# EAGLE design Kube_Base_ESP32_HiLetGo (EAGLE 9.6.2)
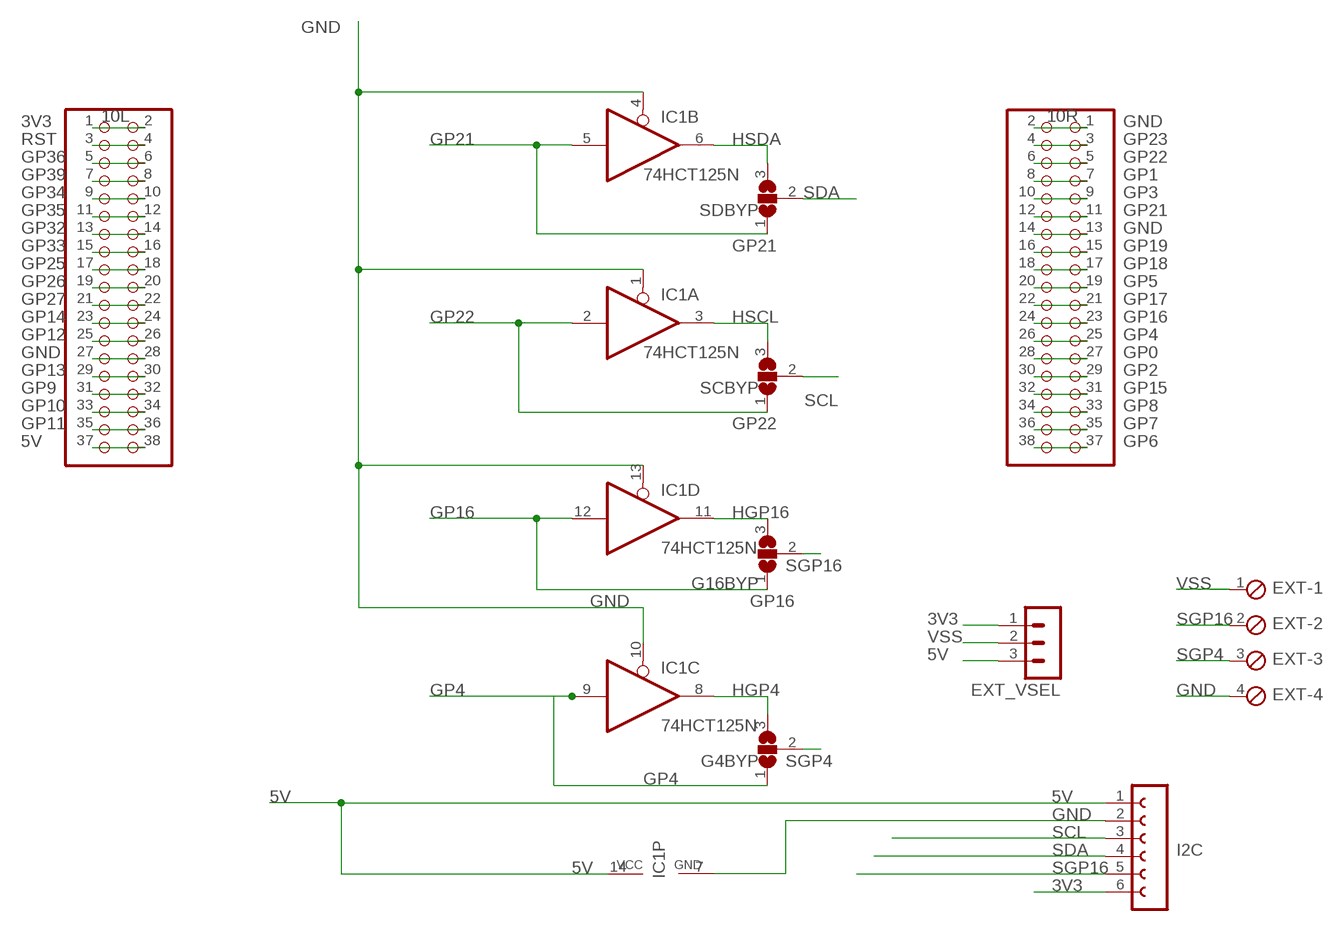
[diagram p0: schematic, sheet 1]

## Parts
10L  15  PINHD-2X19  [2X19]
10R  15  PINHD-2X19  [2X19]
EXT  MPT4  [4POL254]
EXT_VSEL  MA03-1  [MA03-1]
G4BYP  SJ2W  [SJ_2]
G16BYP  SJ2W  [SJ_2]
I2C  FE06-1  [FE06]
IC1  74HCT125N  [DIL14]
SCBYP  SJ2W  [SJ_2]
SDBYP  SJ2W  [SJ_2]

## Nets
3V3: 10L.1 10L.2 EXT_VSEL.1 I2C.6
5V: 10L.37 10L.38 EXT_VSEL.3 I2C.1 IC1.14(P:VCC)
GND: 10L.27 10L.28 10R.1 10R.2 10R.13 10R.14 EXT.4 I2C.2 IC1.1(A:OE) IC1.4(B:OE) IC1.7(P:GND) IC1.10(C:OE) IC1.13(D:OE)
GP0: 10R.27 10R.28
GP1: 10R.7 10R.8
GP2: 10R.29 10R.30
GP3: 10R.9 10R.10
GP4: 10R.25 10R.26 G4BYP.1 IC1.9(C:I)
GP5: 10R.19 10R.20
GP6: 10R.37 10R.38
GP7: 10R.35 10R.36
GP8: 10R.33 10R.34
GP9: 10L.31 10L.32
GP10: 10L.33 10L.34
GP11: 10L.35 10L.36
GP12: 10L.25 10L.26
GP13: 10L.29 10L.30
GP14: 10L.23 10L.24
GP15: 10R.31 10R.32
GP16: 10R.23 10R.24 G16BYP.1 IC1.12(D:I)
GP17: 10R.21 10R.22
GP18: 10R.17 10R.18
GP19: 10R.15 10R.16
GP21: 10R.11 10R.12 IC1.5(B:I) SDBYP.1
GP22: 10R.5 10R.6 IC1.2(A:I) SCBYP.1
GP23: 10R.3 10R.4
GP25: 10L.17 10L.18
GP26: 10L.19 10L.20
GP27: 10L.21 10L.22
GP32: 10L.13 10L.14
GP33: 10L.15 10L.16
GP34: 10L.9 10L.10
GP35: 10L.11 10L.12
GP36: 10L.5 10L.6
GP39: 10L.7 10L.8
HGP4: G4BYP.3 IC1.8(C:O)
HGP16: G16BYP.3 IC1.11(D:O)
HSCL: IC1.3(A:O) SCBYP.3
HSDA: IC1.6(B:O) SDBYP.3
RST: 10L.3 10L.4
SCL: I2C.3 SCBYP.2
SDA: I2C.4 SDBYP.2
SGP4: EXT.3 G4BYP.2
SGP16: EXT.2 G16BYP.2 I2C.5
VSS: EXT.1 EXT_VSEL.2

## Library data of the parts
10L 10R = pinhead:PINHD-2X19: PIN HEADER
EXT = con-phoenix-254:MPT4: PHOENIX CONNECTOR; OC_FARNELL: unknown; OC_NEWARK: unknown
EXT_VSEL = con-lstb:MA03-1: PIN HEADER; OC_FARNELL: unknown; OC_NEWARK: unknown
G4BYP G16BYP SCBYP SDBYP = jumper:SJ2W: SMD solder JUMPER
I2C = con-lsta:FE06-1: FEMALE HEADER; OC_FARNELL: unknown; OC_NEWARK: unknown
IC1 = 74xx-eu:74*125: Quad bus BUFFER, 3-state

## Board
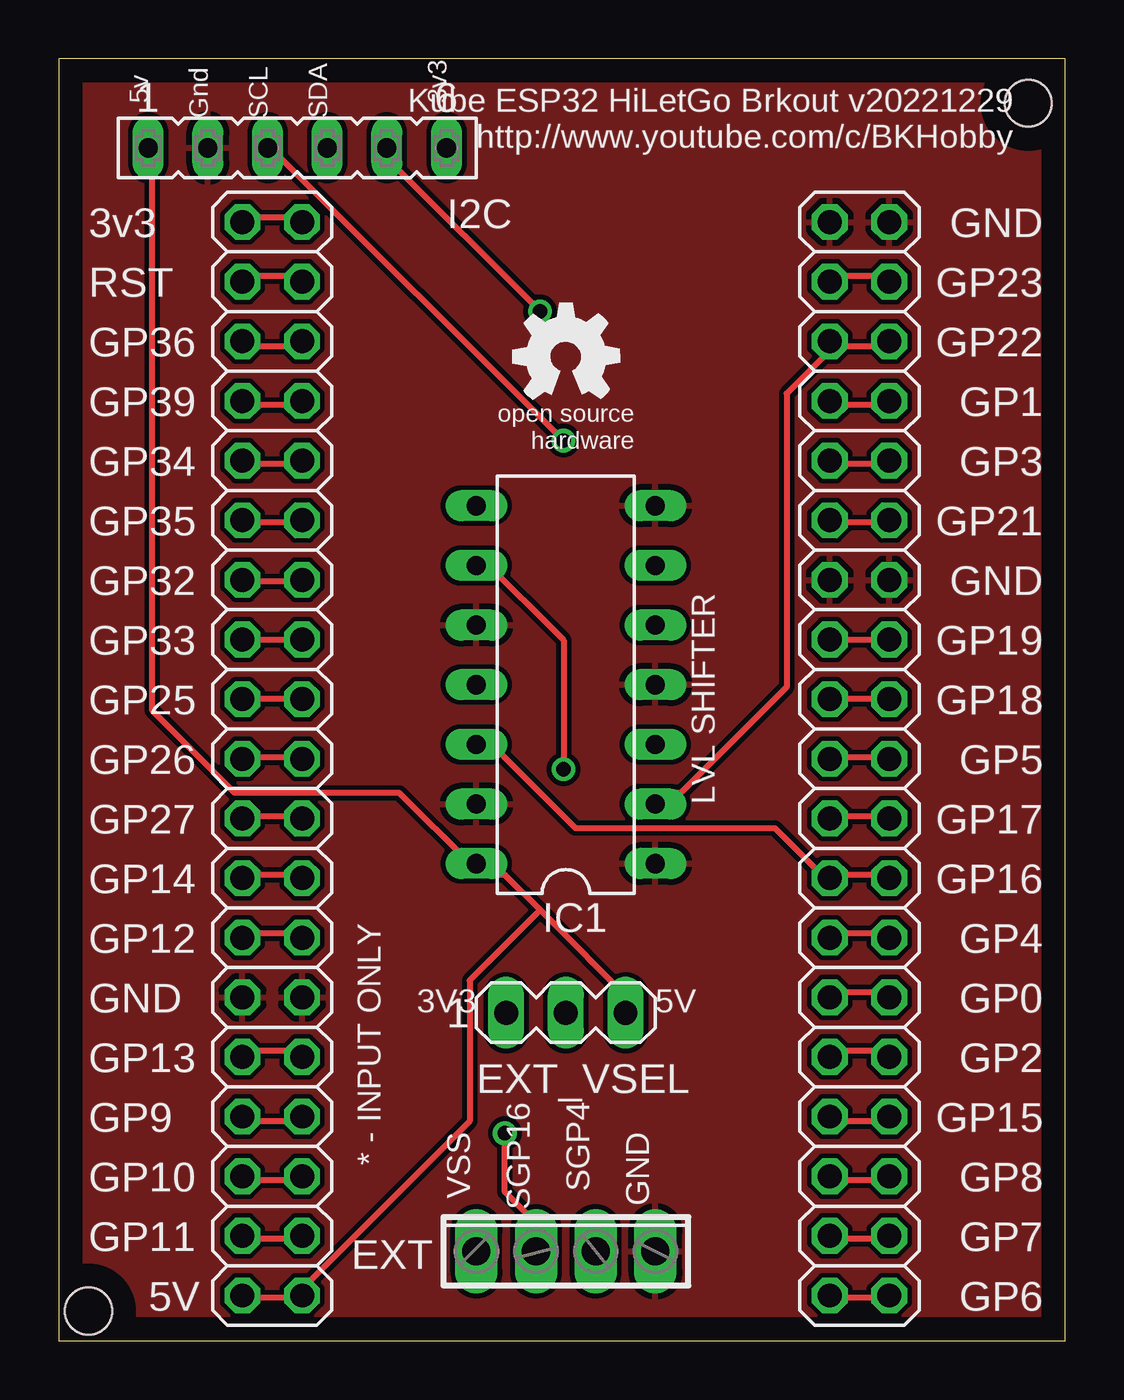
[diagram p1: board, top side]
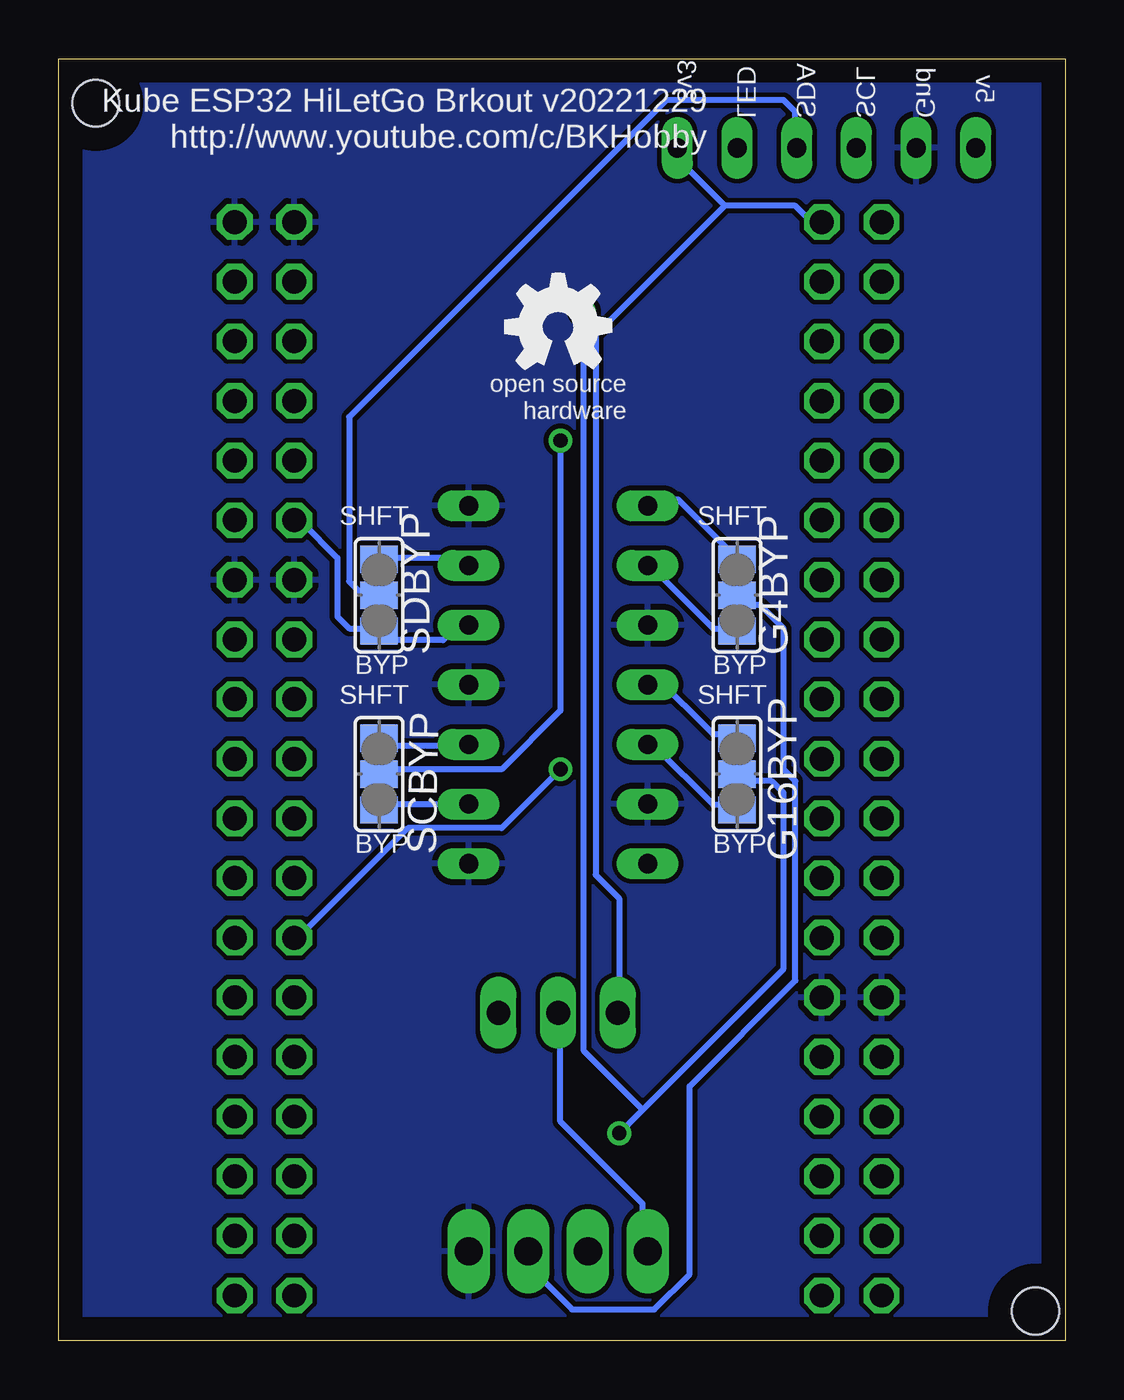
[diagram p2: board, bottom side, seen from below]

Size 42.85 x 54.6 mm. Coordinates in mm from the lower left corner, seen from the top.
Outline: 0,0 42.85,0 42.85,54.6 0,54.6 0,0
Copper layers (1*16): Top 0.035mm / dielectric 1.5mm / Bottom 0.035mm
Design rules "default": minimum track width 10mil, minimum drill 24mil, track to track 8mil, track to pad 8mil, pad to pad 8mil, via to via 8mil, smd to smd 8mil, copper to edge 40mil, drill to drill 8mil, minimum pad ring 10mil, minimum via ring 8mil, stop-mask expansion 4mil, vias tented up to drill 0mil, thermal gap 10mil
Holes 2 mm at 41.27,52.7 1.27,1.27

### Footprints (pad centres in the part's own frame; a part is rotated, then mirrored left to right if it is on the bottom)
2X19 = drill 1.016 octagon: 1 -22.86,-1.27; 2 -22.86,1.27; 3 -20.32,-1.27; 4 -20.32,1.27; 5 -17.78,-1.27; 6 -17.78,1.27; 7 -15.24,-1.27; 8 -15.24,1.27; 9 -12.7,-1.27; 10 -12.7,1.27; 11 -10.16,-1.27; 12 -10.16,1.27; 13 -7.62,-1.27; 14 -7.62,1.27; 15 -5.08,-1.27; 16 -5.08,1.27; 17 -2.54,-1.27; 18 -2.54,1.27; 19 0,-1.27; 20 0,1.27; 21 2.54,-1.27; 22 2.54,1.27; 23 5.08,-1.27; 24 5.08,1.27; 25 7.62,-1.27; 26 7.62,1.27; 27 10.16,-1.27; 28 10.16,1.27; 29 12.7,-1.27; 30 12.7,1.27; 31 15.24,-1.27; 32 15.24,1.27; 33 17.78,-1.27; 34 17.78,1.27; 35 20.32,-1.27; 36 20.32,1.27; 37 22.86,-1.27; 38 22.86,1.27
4POL254 = drill 1.2 long: 1 -3.81,0; 2 -1.27,0; 3 1.27,0; 4 3.81,0
MA03-1 = drill 1.016 long: 1 -2.54,0; 2 0,0; 3 2.54,0
SJ_2 = smd 1.168 x 1.6: 1 -1.524,0; 2 0,0; 3 1.524,0
FE06 = drill 0.813 long: 1 -6.35,0; 2 -3.81,0; 3 -1.27,0; 4 1.27,0; 5 3.81,0; 6 6.35,0
DIL14 = drill 0.813 long: 1 -7.62,-3.81; 2 -5.08,-3.81; 3 -2.54,-3.81; 4 0,-3.81; 5 2.54,-3.81; 6 5.08,-3.81; 7 7.62,-3.81; 8 7.62,3.81; 9 5.08,3.81; 10 2.54,3.81; 11 0,3.81; 12 -2.54,3.81; 13 -5.08,3.81; 14 -7.62,3.81

### Placement (x,y rotation side)
10L  9.09,24.79 270 top
10R  34.09,24.79 270 top
EXT  21.59,3.81 0 top
EXT_VSEL  21.59,13.97 0 top
G4BYP  13.97,31.75 90 bottom
G16BYP  13.97,24.13 90 bottom
I2C  10.16,50.8 0 top
IC1  21.59,27.94 90 top
SCBYP  29.21,24.13 90 bottom
SDBYP  29.21,31.75 90 bottom
U$1  [OSHW_5MM]  21.59,41.91 0 top
U$2  [OSHW_5MM]  21.59,43.18 0 bottom

### Tracks (layer width: path | path; a pad name or v marks a point on that pad's centre or on a via)
3V3
  Top 0.254: 10L.1 7.99,47.84 9.99,47.84 10L.2
  Bottom 0.254: 14.49,48.34 16.49,50.34 I2C.6 | 14.49,48.34 11.49,48.34 10.49,47.34 10L.2 | 14.49,48.34 19.99,42.84 19.99,19.84 18.99,18.84 18.99,14.34 EXT_VSEL.1
5V
  Top 0.254: 10L.37 7.99,1.84 9.99,1.84 10L.38 10.49,2.34 17.49,9.34 17.49,15.34 20.49,18.34 | 20.49,18.34 24.49,14.34 EXT_VSEL.3 | 20.49,18.34 18.99,19.84 17.99,19.84 IC1.14 17.49,20.34 14.49,23.34 7.49,23.34 3.99,26.84 3.99,50.34 I2C.1
GND
  pour Top: 0,0 0,54.61 43.18,54.61 43.18,0
  pour Bottom: 0,0 0,54.61 43.18,54.61 43.18,0
GP0
  Top 0.254: 10R.27 32.99,14.84 34.99,14.84 10R.28
GP1
  Top 0.254: 10R.7 32.99,39.84 34.99,39.84 10R.8
GP2
  Top 0.254: 10R.29 32.99,12.34 34.99,12.34 10R.30
GP3
  Top 0.254: 10R.9 32.99,37.34 34.99,37.34 10R.10
GP4  (via drill 0.61)
  Top 0.254: 10R.25 32.99,17.34 34.99,17.34 10R.26 | v21.49,24.34 21.49,29.84 17.99,33.34 IC1.9
  Bottom 0.254: G4BYP.1 13.99,30.34 14.99,30.34 17.49,32.84 IC1.9 | v21.49,24.34 23.99,21.84 27.99,21.84 32.49,17.34 10R.25
GP5
  Top 0.254: 10R.19 32.99,24.84 34.99,24.84 10R.20
GP6
  Top 0.254: 10R.37 32.99,1.84 34.99,1.84 10R.38
GP7
  Top 0.254: 10R.35 32.99,4.34 34.99,4.34 10R.36
GP8
  Top 0.254: 10R.33 32.99,6.84 34.99,6.84 10R.34
GP9
  Top 0.254: 10L.31 7.99,9.34 9.99,9.34 10L.32
GP10
  Top 0.254: 10L.33 7.99,6.84 9.99,6.84 10L.34
GP11
  Top 0.254: 10L.35 7.99,4.34 9.99,4.34 10L.36
GP12
  Top 0.254: 10L.25 7.99,17.34 9.99,17.34 10L.26
GP13
  Top 0.254: 10L.29 7.99,12.34 9.99,12.34 10L.30
GP14
  Top 0.254: 10L.23 7.99,19.84 9.99,19.84 10L.24
GP15
  Top 0.254: 10R.31 32.99,9.34 34.99,9.34 10R.32
GP16
  Top 0.254: 10R.24 34.99,19.84 32.99,19.84 10R.23 32.49,19.84 30.49,21.84 21.99,21.84 17.99,25.84 IC1.12
  Bottom 0.254: G16BYP.1 13.99,22.84 14.99,22.84 17.49,25.34 IC1.12
GP17
  Top 0.254: 10R.21 32.99,22.34 34.99,22.34 10R.22
GP18
  Top 0.254: 10R.17 32.99,27.34 34.99,27.34 10R.18
GP19
  Top 0.254: 10R.15 32.99,29.84 34.99,29.84 10R.16
GP21
  Top 0.254: 10R.11 32.99,34.84 34.99,34.84 10R.12
  Bottom 0.254: IC1.5 25.49,30.84 26.49,29.84 28.99,29.84 SDBYP.1 29.49,30.34 30.49,30.34 30.99,30.84 30.99,33.34 32.49,34.84 10R.11
GP22
  Top 0.254: 32.99,42.34 34.99,42.34 10R.6 | 32.99,42.34 30.99,40.34 30.99,27.84 26.49,23.34 25.49,23.34 IC1.2 | 32.99,42.34 10R.5
  Bottom 0.254: SCBYP.1 28.99,22.84 25.49,22.84 IC1.2
GP23
  Top 0.254: 10R.3 32.99,45.34 34.99,45.34 10R.4
GP25
  Top 0.254: 10L.17 7.99,27.34 9.99,27.34 10L.18
GP26
  Top 0.254: 10L.19 7.99,24.84 9.99,24.84 10L.20
GP27
  Top 0.254: 10L.21 7.99,22.34 9.99,22.34 10L.22
GP32
  Top 0.254: 10L.13 7.99,32.34 9.99,32.34 10L.14
GP33
  Top 0.254: 10L.15 7.99,29.84 9.99,29.84 10L.16
GP34
  Top 0.254: 10L.9 7.99,37.34 9.99,37.34 10L.10
GP35
  Top 0.254: 10L.11 7.99,34.84 9.99,34.84 10L.12
GP36
  Top 0.254: 10L.5 7.99,42.34 9.99,42.34 10L.6
GP39
  Top 0.254: 10L.7 7.99,39.84 9.99,39.84 10L.8
HGP4
  Bottom 0.254: G4BYP.3 13.99,33.34 16.49,35.84 17.49,35.84 IC1.8
HGP16
  Bottom 0.254: G16BYP.3 13.99,25.84 14.99,25.84 17.49,28.34 IC1.11
HSCL
  Bottom 0.254: SCBYP.3 28.99,25.34 25.49,25.34 IC1.3
HSDA
  Bottom 0.254: SDBYP.3 28.99,33.34 25.49,33.34 IC1.6
RST
  Top 0.254: 10L.3 7.99,45.34 9.99,45.34 10L.4
SCL  (via drill 0.61)
  Top 0.254: v21.49,38.34 8.99,50.84 I2C.3
  Bottom 0.254: v21.49,38.34 21.49,26.84 23.99,24.34 28.99,24.34 SCBYP.2
SDA
  Bottom 0.254: SDBYP.2 29.49,31.84 29.99,31.84 30.49,32.34 30.49,39.34 16.99,52.84 11.99,52.84 11.49,52.34 11.49,50.84 I2C.4
SGP4
  Bottom 0.254: G4BYP.2 13.49,31.34 12.99,31.34 11.99,30.34 11.99,24.34 11.49,23.84 11.49,15.34 15.99,10.84 15.99,2.84 17.49,1.34 20.99,1.34 22.99,3.34 EXT.3
SGP16  (via drill 0.61)
  Top 0.254: v18.99,8.84 18.99,6.34 19.99,5.34 19.99,3.84 EXT.2 | v20.49,43.84 13.99,50.34 I2C.5
  Bottom 0.254: v18.99,8.84 17.99,9.84 | 17.99,9.84 11.99,15.84 11.99,23.34 12.49,23.84 13.49,23.84 G16BYP.2 | v20.49,43.84 20.49,12.34 17.99,9.84
VSS
  Bottom 0.254: EXT_VSEL.2 21.49,13.84 21.49,9.34 17.99,5.84 17.99,3.84 EXT.1

### Text on the board
tNames: Kube ESP32 HiLetGo Brkout v20221229 / http://www.youtube.com/c/BKHobby | 5v | 3v3 | Gnd | SCL | SDA | GND | 3v3 | GP23 | RST | GP22 | GP36 | GP1 | GP39 | GP3 | GP34 | GP21 | GP35 | GND | GP32 | GP19 | GP33 | GP18 | GP25 | GP5 | GP26 | LVL SHIFTER | GP17 | GP27 | GP16 | GP14 | * - INPUT ONLY | GP4 | GP12 | GP0 | GND | 3V3 | 5V | GP2 | GP13 | SGP16 | SGP4 | GP15 | GP9 | VSS | GND | GP8 | GP10 | GP7 | GP11 | GP6 | 5V
bNames: Kube ESP32 HiLetGo Brkout v20221229 / http://www.youtube.com/c/BKHobby | 5v | 3v3 | Gnd | SCL | SDA | LED | SHFT | SHFT | BYP | BYP | SHFT | SHFT | BYP | BYP